# EAGLE schematic sendreceive (EAGLE 7.1.0)
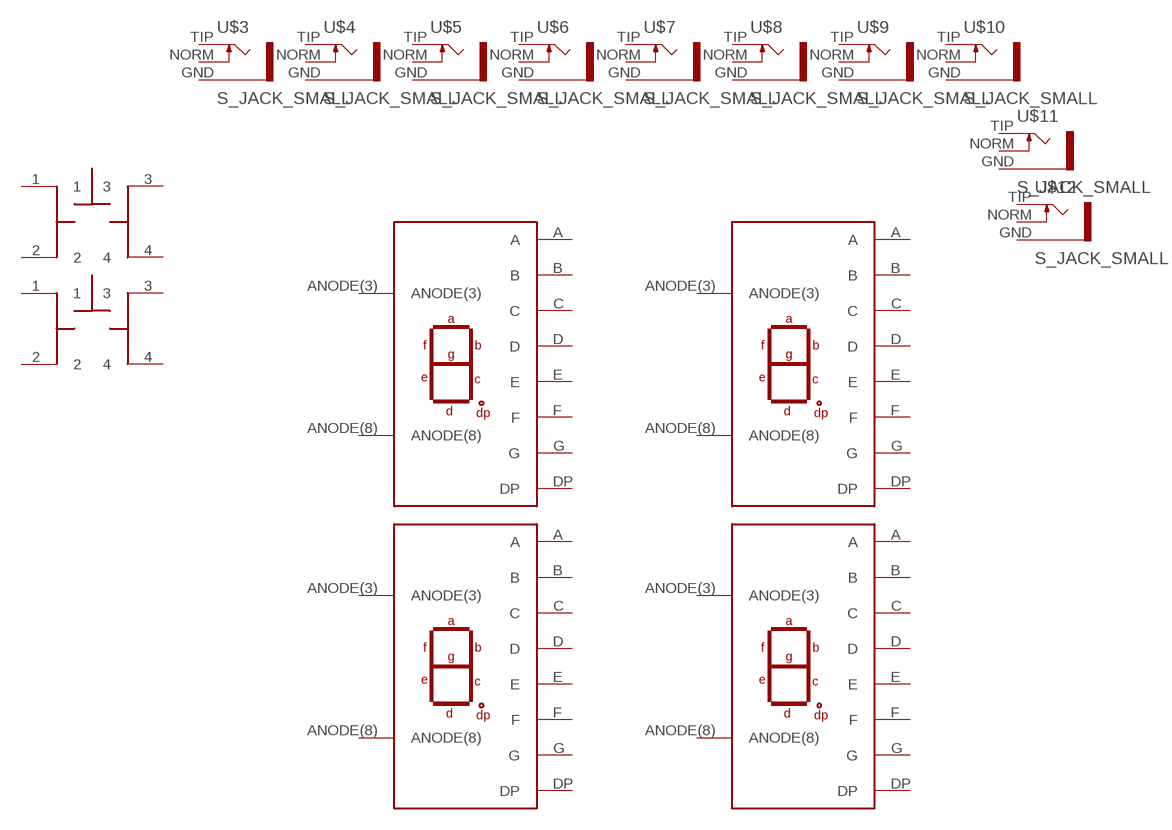
[diagram p0: schematic, sheet 1]

## Parts
U$1  SEVEN_SEG  [SEVEN_SEG]
U$2  SEVEN_SEG  [SEVEN_SEG]
U$3  S_JACK_SMALL  [S_JACK_SMALL]
U$4  S_JACK_SMALL  [S_JACK_SMALL]
U$5  S_JACK_SMALL  [S_JACK_SMALL]
U$6  S_JACK_SMALL  [S_JACK_SMALL]
U$7  S_JACK_SMALL  [S_JACK_SMALL]
U$8  S_JACK_SMALL  [S_JACK_SMALL]
U$9  S_JACK_SMALL  [S_JACK_SMALL]
U$10  S_JACK_SMALL  [S_JACK_SMALL]
U$11  S_JACK_SMALL  [S_JACK_SMALL]
U$12  S_JACK_SMALL  [S_JACK_SMALL]
U$13  TACT_SWITCH_SMALL  [TACT_SWITC_SMALL]
U$14  TACT_SWITCH_SMALL  [TACT_SWITC_SMALL]
U$15  SEVEN_SEG_SMALL  [SEVEN_SEG_SMALL]
U$16  SEVEN_SEG_SMALL  [SEVEN_SEG_SMALL]
Unconnected: U$1.A U$1.ANODE(3) U$1.ANODE(8) U$1.B U$1.C U$1.D U$1.DP U$1.E U$1.F U$1.G U$2.A U$2.ANODE(3) U$2.ANODE(8) U$2.B U$2.C U$2.D U$2.DP U$2.E U$2.F U$2.G U$3.GND U$3.NORM U$3.TIP U$4.GND U$4.NORM U$4.TIP U$5.GND U$5.NORM U$5.TIP U$6.GND U$6.NORM U$6.TIP U$7.GND U$7.NORM U$7.TIP U$8.GND U$8.NORM U$8.TIP U$9.GND U$9.NORM U$9.TIP U$10.GND U$10.NORM U$10.TIP U$11.GND U$11.NORM U$11.TIP U$12.GND U$12.NORM U$12.TIP U$13.1 U$13.2 U$13.3 U$13.4 U$14.1 U$14.2 U$14.3 U$14.4 U$15.A U$15.ANODE(3) U$15.ANODE(8) U$15.B U$15.C U$15.D U$15.DP U$15.E U$15.F U$15.G U$16.A U$16.ANODE(3) U$16.ANODE(8) U$16.B U$16.C U$16.D U$16.DP U$16.E U$16.F U$16.G

## Library data of the parts
U$1 U$2 = QuBit:SEVEN_SEG: Common Anode Mouser Part #: 78-TDSO5150 Manufacturer Part #: TDSO5150 Manufacturer: Vishay Semiconductors
U$3-U$12 = QuBit:S_JACK_SMALL
U$13 U$14 = QuBit:TACT_SWITCH_SMALL: Mouser Part #: 612-TL1105SP Manufacturer Part #: TL1105SPF160Q Manufacturer: E-Switch Description: Tactile Switches 6.0X2.8MM 160G
U$15 U$16 = QuBit:SEVEN_SEG_SMALL: Mouser Part #: 78-TDSO3150 Manufacturer Part #: TDSO3150 Manufacturer: Vishay Semiconductors Description: LED Displays & Accessories 7-Seg Org 0.45mcd Common Anode